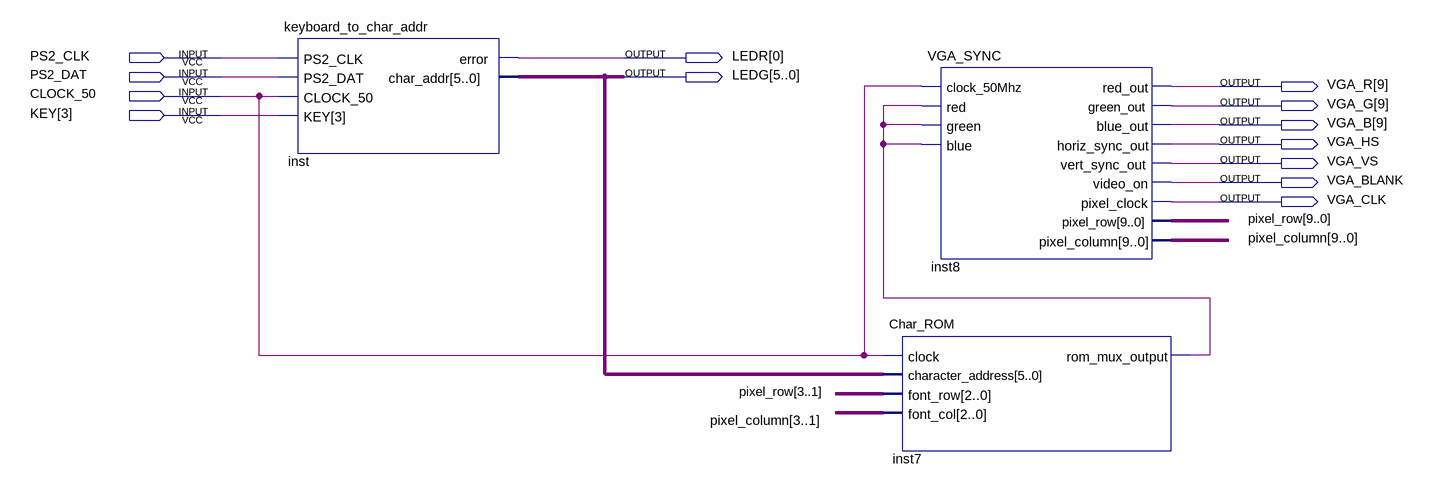
[diagram p0: schematic sheet]
// Quartus schematic temp.bdf as structural Verilog: 3 symbols, 13 pins
module temp (
  input  PS2_CLK,
  input  PS2_DAT,
  input  CLOCK_50,
  input  [3:3] KEY,
  output [0:0] LEDR,
  output [5:0] LEDG,
  output [9:9] VGA_R,
  output [9:9] VGA_G,
  output [9:9] VGA_B,
  output VGA_HS,
  output VGA_VS,
  output VGA_BLANK,
  output VGA_CLK
);

  wire inst7_rom_mux_output;
  wire [9:0] pixel_column, pixel_row;

  keyboard_to_char_addr inst (
    .PS2_CLK(PS2_CLK), .PS2_DAT(PS2_DAT), .CLOCK_50(CLOCK_50), .KEY(KEY[3]), .error(LEDR[0]), .char_addr(LEDG));
  Char_ROM inst7 (
    .clock(CLOCK_50), .character_address(LEDG), .font_row(pixel_row[3:1]), .font_col(pixel_column[3:1]),
    .rom_mux_output(inst7_rom_mux_output));
  VGA_SYNC inst8 (
    .clock_50Mhz(CLOCK_50), .red(inst7_rom_mux_output), .green(inst7_rom_mux_output),
    .blue(inst7_rom_mux_output), .red_out(VGA_R[9]), .green_out(VGA_G[9]), .blue_out(VGA_B[9]),
    .horiz_sync_out(VGA_HS), .vert_sync_out(VGA_VS), .video_on(VGA_BLANK), .pixel_clock(VGA_CLK),
    .pixel_row(pixel_row), .pixel_column(pixel_column));
endmodule
